# EAGLE design 8x8-LED-Matrix-Rev3 (EAGLE 5.11)
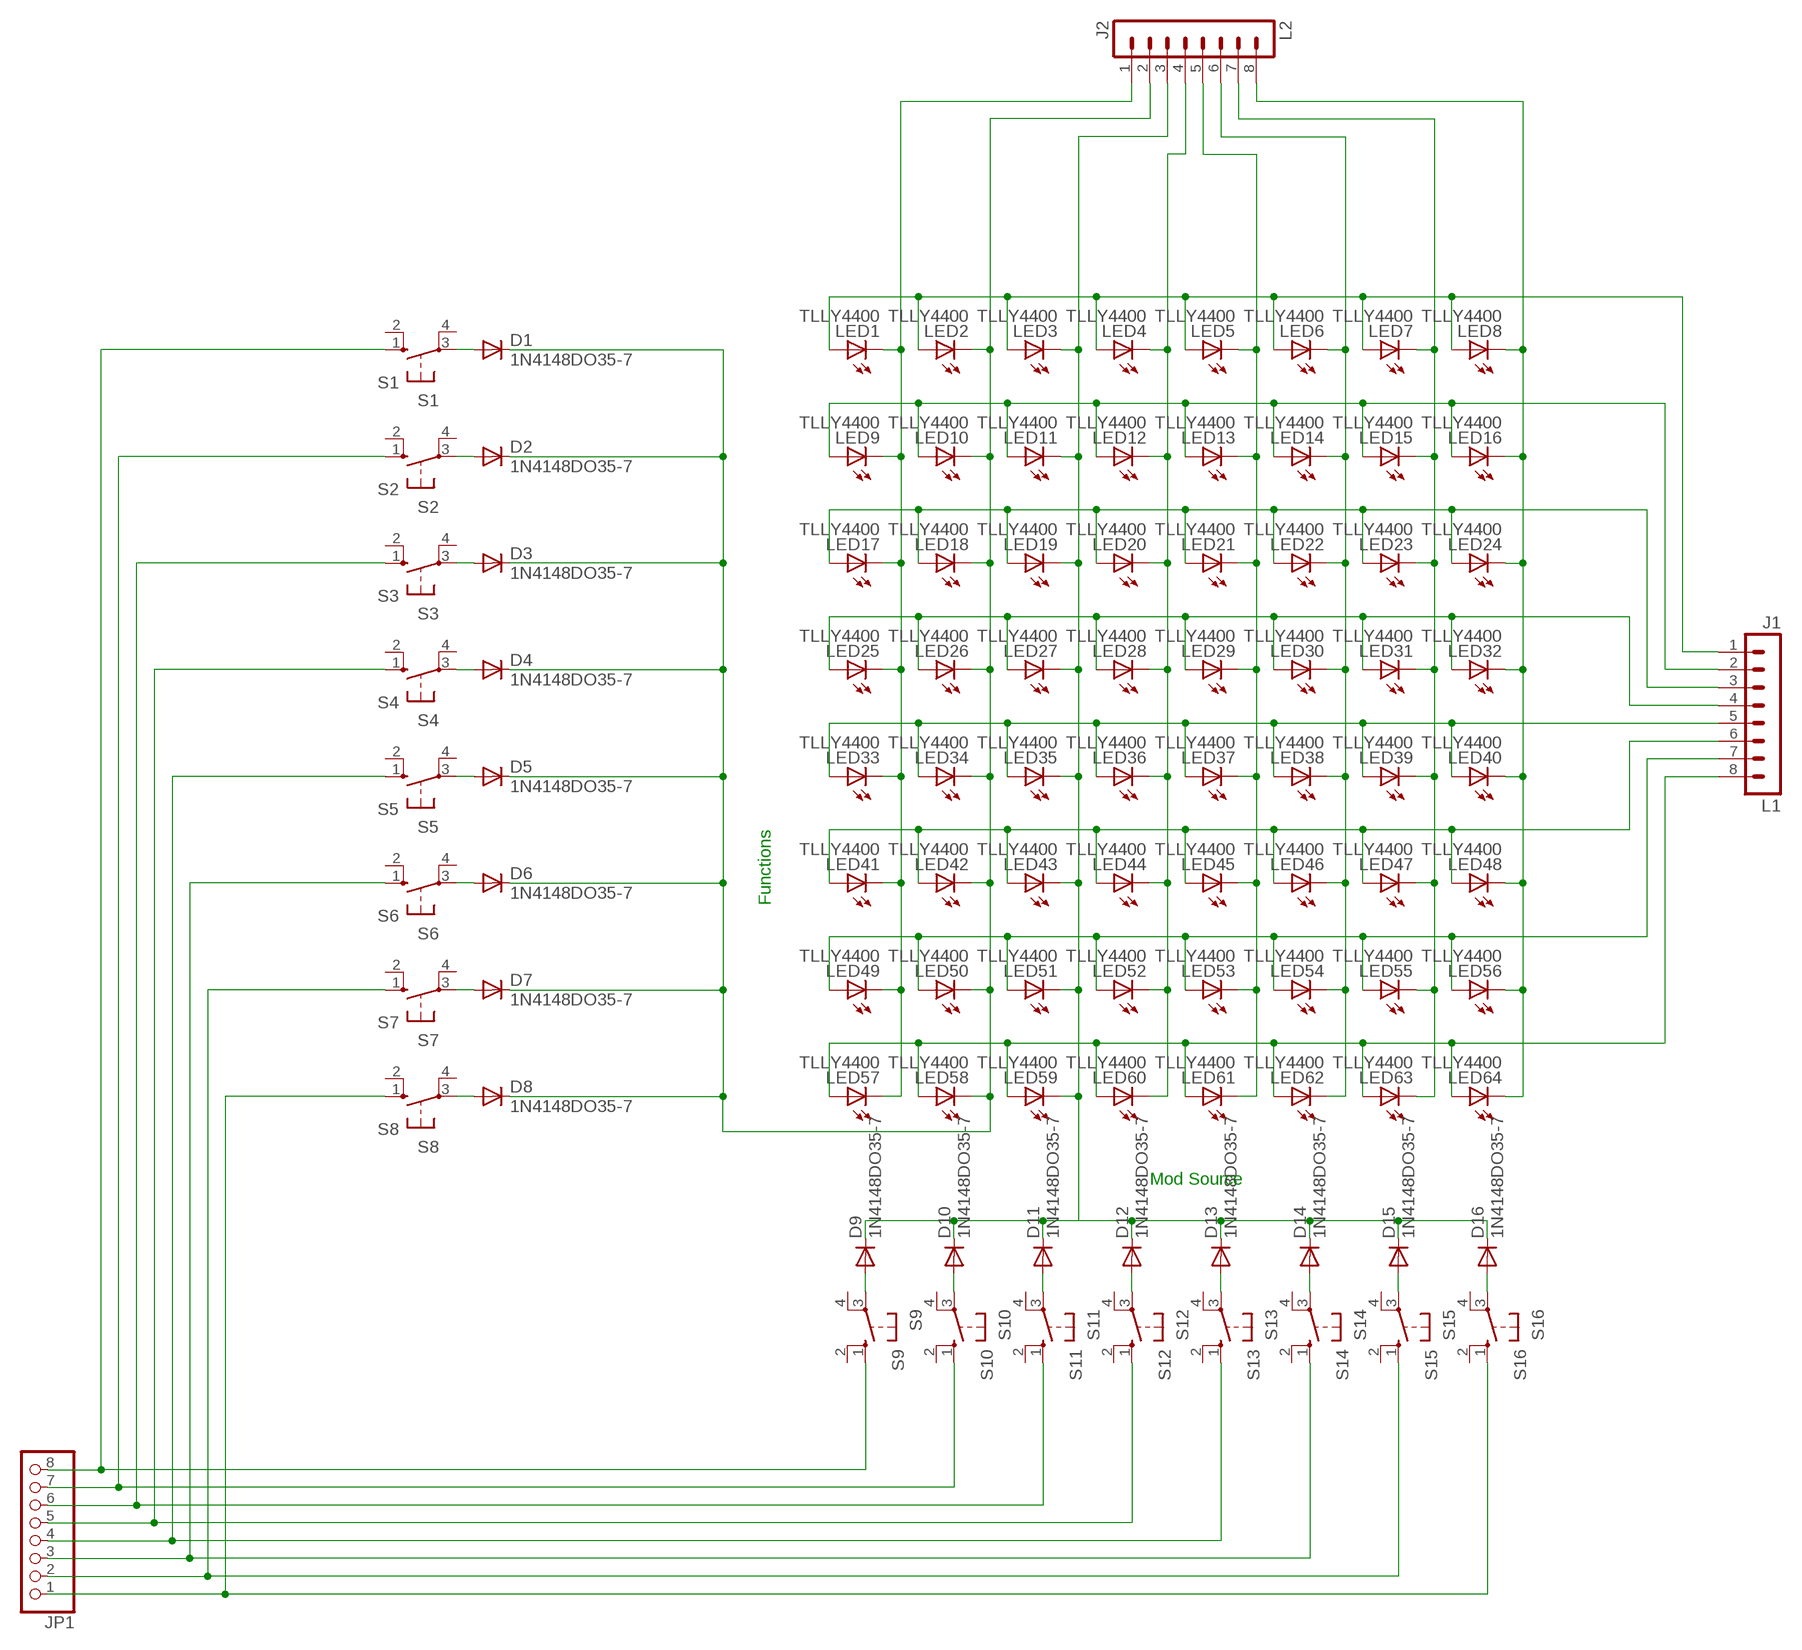
[diagram p0: schematic, sheet 1]

## Parts
D1  1N4148DO35-7  [DO35-7]
D2  1N4148DO35-7  [DO35-7]
D3  1N4148DO35-7  [DO35-7]
D4  1N4148DO35-7  [DO35-7]
D5  1N4148DO35-7  [DO35-7]
D6  1N4148DO35-7  [DO35-7]
D7  1N4148DO35-7  [DO35-7]
D8  1N4148DO35-7  [DO35-7]
D9  1N4148DO35-7  [DO35-7]
D10  1N4148DO35-7  [DO35-7]
D11  1N4148DO35-7  [DO35-7]
D12  1N4148DO35-7  [DO35-7]
D13  1N4148DO35-7  [DO35-7]
D14  1N4148DO35-7  [DO35-7]
D15  1N4148DO35-7  [DO35-7]
D16  1N4148DO35-7  [DO35-7]
JP1  PINHD-1X8  [1X08]
L1  J1  MA08-1  [MA08-1]
L2  J2  MA08-1  [MA08-1]
LED1  TLLY4400  [LED3MM]
LED2  TLLY4400  [LED3MM]
LED3  TLLY4400  [LED3MM]
LED4  TLLY4400  [LED3MM]
LED5  TLLY4400  [LED3MM]
LED6  TLLY4400  [LED3MM]
LED7  TLLY4400  [LED3MM]
LED8  TLLY4400  [LED3MM]
LED9  TLLY4400  [LED3MM]
LED10  TLLY4400  [LED3MM]
LED11  TLLY4400  [LED3MM]
LED12  TLLY4400  [LED3MM]
LED13  TLLY4400  [LED3MM]
LED14  TLLY4400  [LED3MM]
LED15  TLLY4400  [LED3MM]
LED16  TLLY4400  [LED3MM]
LED17  TLLY4400  [LED3MM]
LED18  TLLY4400  [LED3MM]
LED19  TLLY4400  [LED3MM]
LED20  TLLY4400  [LED3MM]
LED21  TLLY4400  [LED3MM]
LED22  TLLY4400  [LED3MM]
LED23  TLLY4400  [LED3MM]
LED24  TLLY4400  [LED3MM]
LED25  TLLY4400  [LED3MM]
LED26  TLLY4400  [LED3MM]
LED27  TLLY4400  [LED3MM]
LED28  TLLY4400  [LED3MM]
LED29  TLLY4400  [LED3MM]
LED30  TLLY4400  [LED3MM]
LED31  TLLY4400  [LED3MM]
LED32  TLLY4400  [LED3MM]
LED33  TLLY4400  [LED3MM]
LED34  TLLY4400  [LED3MM]
LED35  TLLY4400  [LED3MM]
LED36  TLLY4400  [LED3MM]
LED37  TLLY4400  [LED3MM]
LED38  TLLY4400  [LED3MM]
LED39  TLLY4400  [LED3MM]
LED40  TLLY4400  [LED3MM]
LED41  TLLY4400  [LED3MM]
LED42  TLLY4400  [LED3MM]
LED43  TLLY4400  [LED3MM]
LED44  TLLY4400  [LED3MM]
LED45  TLLY4400  [LED3MM]
LED46  TLLY4400  [LED3MM]
LED47  TLLY4400  [LED3MM]
LED48  TLLY4400  [LED3MM]
LED49  TLLY4400  [LED3MM]
LED50  TLLY4400  [LED3MM]
LED51  TLLY4400  [LED3MM]
LED52  TLLY4400  [LED3MM]
LED53  TLLY4400  [LED3MM]
LED54  TLLY4400  [LED3MM]
LED55  TLLY4400  [LED3MM]
LED56  TLLY4400  [LED3MM]
LED57  TLLY4400  [LED3MM]
LED58  TLLY4400  [LED3MM]
LED59  TLLY4400  [LED3MM]
LED60  TLLY4400  [LED3MM]
LED61  TLLY4400  [LED3MM]
LED62  TLLY4400  [LED3MM]
LED63  TLLY4400  [LED3MM]
LED64  TLLY4400  [LED3MM]
S1  S1  10-XX  [B3F-10XX]
S2  S2  10-XX  [B3F-10XX]
S3  S3  10-XX  [B3F-10XX]
S4  S4  10-XX  [B3F-10XX]
S5  S5  10-XX  [B3F-10XX]
S6  S6  10-XX  [B3F-10XX]
S7  S7  10-XX  [B3F-10XX]
S8  S8  10-XX  [B3F-10XX]
S9  S9  10-XX  [B3F-10XX]
S10  S10  10-XX  [B3F-10XX]
S11  S11  10-XX  [B3F-10XX]
S12  S12  10-XX  [B3F-10XX]
S13  S13  10-XX  [B3F-10XX]
S14  S14  10-XX  [B3F-10XX]
S15  S15  10-XX  [B3F-10XX]
S16  S16  10-XX  [B3F-10XX]

## Nets
N$1: L1.1 LED1.A LED2.A LED3.A LED4.A LED5.A LED6.A LED7.A LED8.A
N$2: L1.2 LED9.A LED10.A LED11.A LED12.A LED13.A LED14.A LED15.A LED16.A
N$3: L1.3 LED17.A LED18.A LED19.A LED20.A LED21.A LED22.A LED23.A LED24.A
N$4: L1.4 LED25.A LED26.A LED27.A LED28.A LED29.A LED30.A LED31.A LED32.A
N$5: L1.5 LED33.A LED34.A LED35.A LED36.A LED37.A LED38.A LED39.A LED40.A
N$6: L1.6 LED41.A LED42.A LED43.A LED44.A LED45.A LED46.A LED47.A LED48.A
N$7: D3.A S3.3(P)
N$8: L1.8 LED57.A LED58.A LED59.A LED60.A LED61.A LED62.A LED63.A LED64.A
N$9: L2.1 LED1.K(C) LED9.K(C) LED17.K(C) LED25.K(C) LED33.K(C) LED41.K(C) LED49.K(C) LED57.K(C)
N$10: D1.C D2.C D3.C D4.C D5.C D6.C D7.C D8.C L2.2 LED2.K(C) LED10.K(C) LED18.K(C) LED26.K(C) LED34.K(C) LED42.K(C) LED50.K(C) LED58.K(C)
N$11: D9.C D10.C D11.C D12.C D13.C D14.C D15.C D16.C L2.3 LED3.K(C) LED11.K(C) LED19.K(C) LED27.K(C) LED35.K(C) LED43.K(C) LED51.K(C) LED59.K(C)
N$12: L2.4 LED4.K(C) LED12.K(C) LED20.K(C) LED28.K(C) LED36.K(C) LED44.K(C) LED52.K(C) LED60.K(C)
N$13: L2.5 LED5.K(C) LED13.K(C) LED21.K(C) LED29.K(C) LED37.K(C) LED45.K(C) LED53.K(C) LED61.K(C)
N$14: L2.6 LED6.K(C) LED14.K(C) LED22.K(C) LED30.K(C) LED38.K(C) LED46.K(C) LED54.K(C) LED62.K(C)
N$15: L2.7 LED7.K(C) LED15.K(C) LED23.K(C) LED31.K(C) LED39.K(C) LED47.K(C) LED55.K(C) LED63.K(C)
N$16: L2.8 LED8.K(C) LED16.K(C) LED24.K(C) LED32.K(C) LED40.K(C) LED48.K(C) LED56.K(C) LED64.K(C)
N$17: L1.7 LED49.A LED50.A LED51.A LED52.A LED53.A LED54.A LED55.A LED56.A
N$18: JP1.8 S1.1(S) S9.1(S)
N$19: JP1.7 S2.1(S) S10.1(S)
N$20: JP1.5 S4.1(S) S12.1(S)
N$21: JP1.4 S5.1(S) S13.1(S)
N$22: JP1.3 S6.1(S) S14.1(S)
N$23: JP1.2 S7.1(S) S15.1(S)
N$24: JP1.1 S8.1(S) S16.1(S)
N$25: JP1.6 S3.1(S) S11.1(S)
N$26: D4.A S4.3(P)
N$27: D5.A S5.3(P)
N$28: D6.A S6.3(P)
N$29: D7.A S7.3(P)
N$30: D8.A S8.3(P)
N$32: D9.A S9.3(P)
N$33: D10.A S10.3(P)
N$38: D11.A S11.3(P)
N$39: D12.A S12.3(P)
N$40: D13.A S13.3(P)
N$41: D14.A S14.3(P)
N$42: D15.A S15.3(P)
N$43: D16.A S16.3(P)
N$48: D1.A S1.3(P)
N$49: D2.A S2.3(P)
Unconnected: S1.2(S1) S1.4(P1) S2.2(S1) S2.4(P1) S3.2(S1) S3.4(P1) S4.2(S1) S4.4(P1) S5.2(S1) S5.4(P1) S6.2(S1) S6.4(P1) S7.2(S1) S7.4(P1) S8.2(S1) S8.4(P1) S9.2(S1) S9.4(P1) S10.2(S1) S10.4(P1) S11.2(S1) S11.4(P1) S12.2(S1) S12.4(P1) S13.2(S1) S13.4(P1) S14.2(S1) S14.4(P1) S15.2(S1) S15.4(P1) S16.2(S1) S16.4(P1)

## Notes on the sheet
- Functions
- Mod Source

## Library data of the parts
D1-D16 = diode:1N4148: DIODE high speed (Philips)
JP1 = pinhead:PINHD-1X8: PIN HEADER
L1 L2 = con-lstb:MA08-1: PIN HEADER; OC_FARNELL: unknown; OC_NEWARK: unknown
LED1-LED64 = led:TLLY4400: Low Current (2mA) LED 3 mm Tinted Diffused Package color YELLOW Source: Data sheet <http://www.farnell.com/datasheets/391098.pdf>; MF: VISHAY SEMICONDUCTOR; OC_FARNELL: 1612439
S1-S16 = switch-omron:10-XX: OMRON SWITCH; MPN: B3F-1000; OC_FARNELL: 176432; OC_NEWARK: 36M3542

## Board
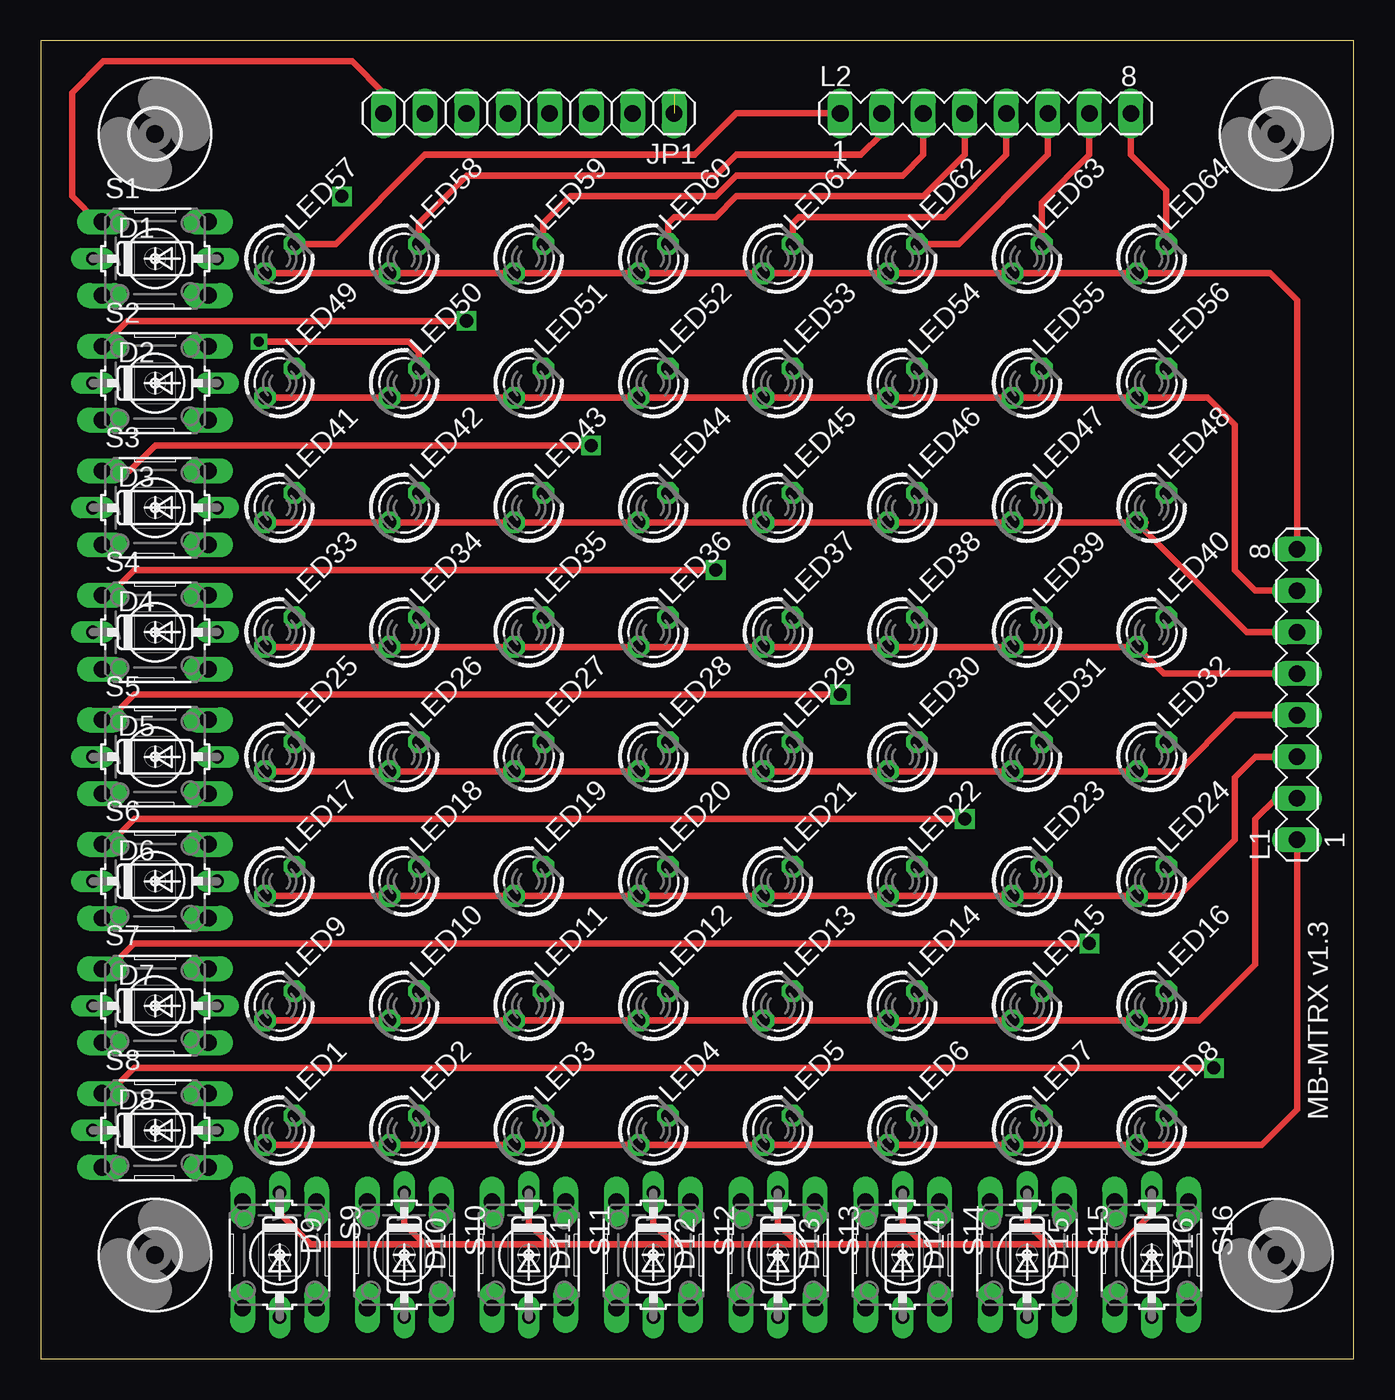
[diagram p1: board, top side]
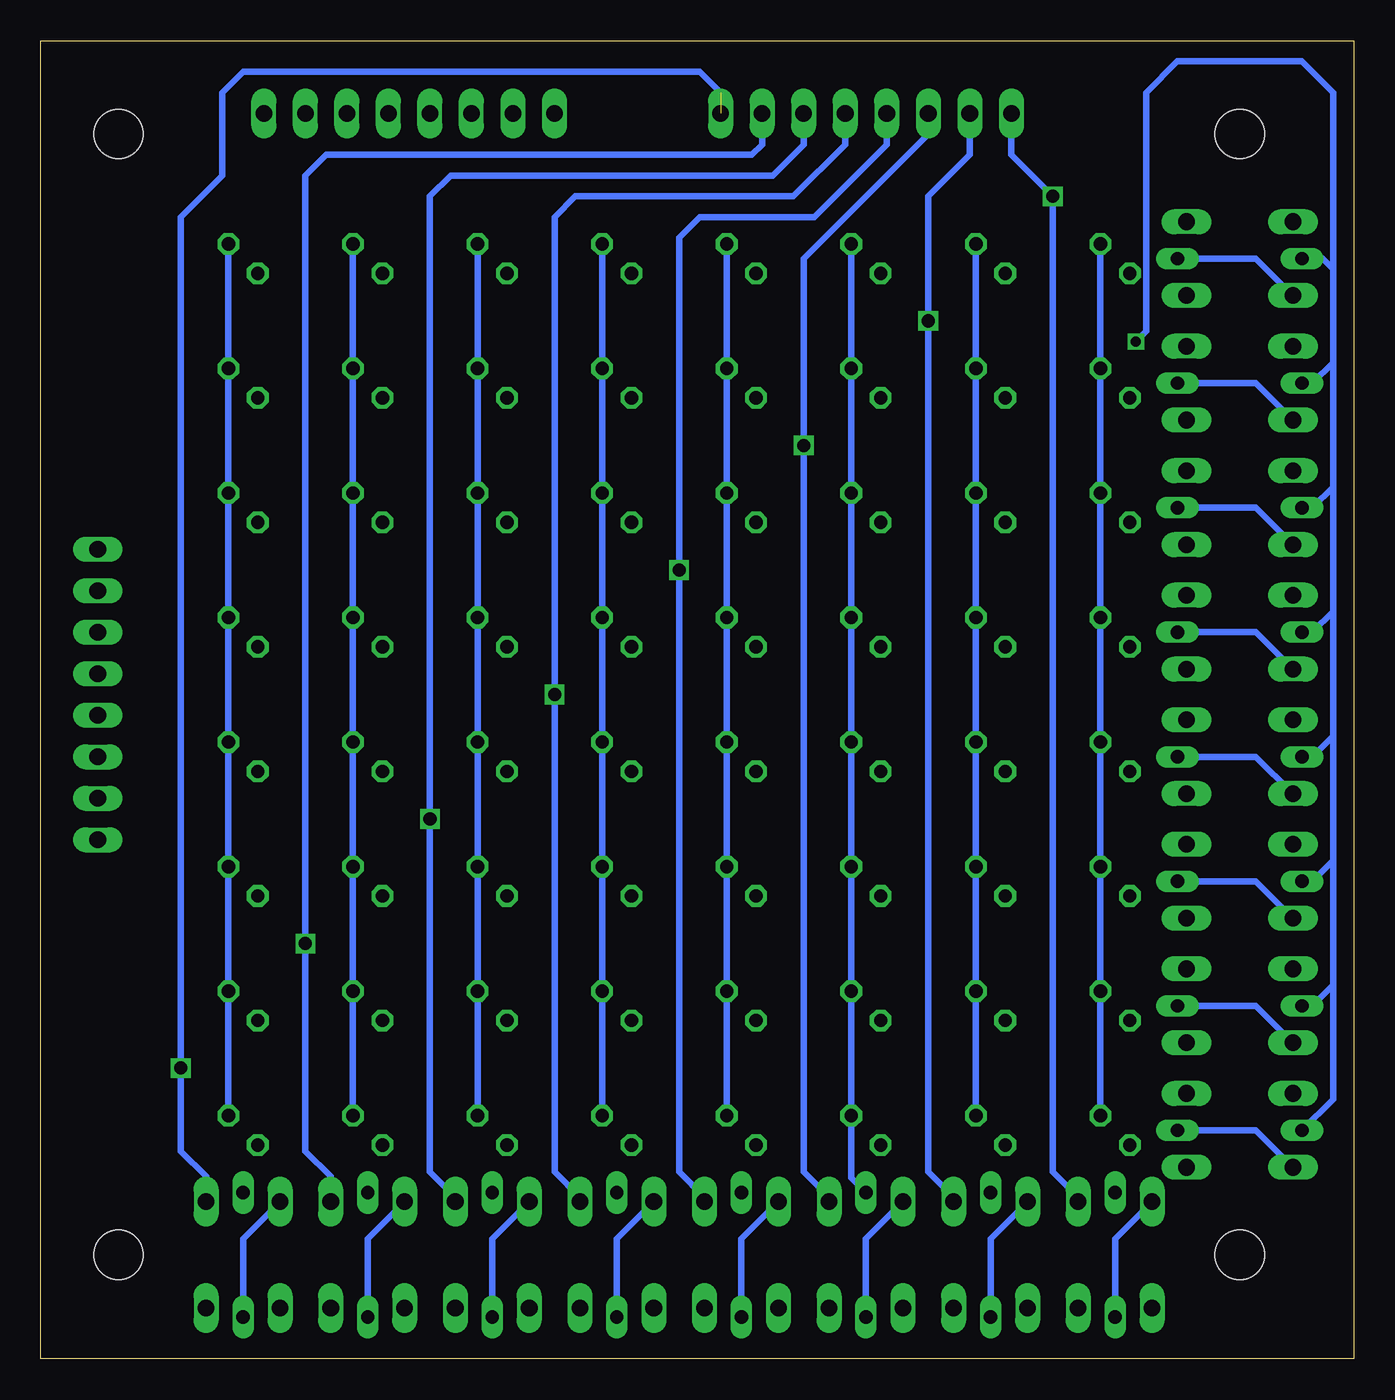
[diagram p2: board, bottom side, seen from below]

Size 80.31 x 80.64 mm. Coordinates in mm from the lower left corner, seen from the top.
Outline: 0,0 80.31,0 80.31,80.64 0,80.64 0,0
Copper layers (1*16): Top 0.035mm / dielectric 1.5mm / Bottom 0.035mm
Design rules "batchpcb": minimum track width 8mil, minimum drill 20mil, track to track 8mil, track to pad 8mil, pad to pad 8mil, via to via 8mil, smd to smd 8mil, copper to edge 40mil, drill to drill 8mil, minimum pad ring 10mil, minimum via ring 8mil, stop-mask expansion 4mil, vias tented up to drill 0mil, thermal gap 10mil

### Footprints (pad centres in the part's own frame; a part is rotated, then mirrored left to right if it is on the bottom)
DO35-7 = drill 0.813 long: A 3.81,0; C -3.81,0
1X08 = drill 1.016 long: 1 -8.89,0; 2 -6.35,0; 3 -3.81,0; 4 -1.27,0; 5 1.27,0; 6 3.81,0; 7 6.35,0; 8 8.89,0
MA08-1 = drill 1.016 long: 1 -8.89,0; 2 -6.35,0; 3 -3.81,0; 4 -1.27,0; 5 1.27,0; 6 3.81,0; 7 6.35,0; 8 8.89,0
LED3MM = drill 0.813 octagon: A -1.27,0; K 1.27,0
B3F-10XX = drill 1.016 long: 1 -3.251,2.261; 2 3.251,2.261; 3 -3.251,-2.261; 4 3.251,-2.261
3,0 = hole 3: 0,0

### Placement (x,y rotation side)
D1  6.99,67.31 0 top
D2  6.99,59.69 0 top
D3  6.99,52.07 0 top
D4  6.99,44.45 0 top
D5  6.99,36.83 0 top
D6  6.99,29.21 0 top
D7  6.99,21.59 0 top
D8  6.99,13.97 0 top
D9  14.61,6.35 270 top
D10  22.23,6.35 270 top
D11  29.84,6.35 270 top
D12  37.47,6.35 270 top
D13  45.09,6.35 270 top
D14  52.7,6.35 270 top
D15  60.33,6.35 270 top
D16  67.94,6.35 270 top
JP1  29.84,76.2 180 top
L1  76.83,40.64 90 top
L2  57.78,76.2 0 top
LED1  14.61,13.97 45 top
LED2  22.23,13.97 45 top
LED3  29.84,13.97 45 top
LED4  37.47,13.97 45 top
LED5  45.09,13.97 45 top
LED6  52.7,13.97 45 top
LED7  60.33,13.97 45 top
LED8  67.94,13.97 45 top
LED9  14.61,21.59 45 top
LED10  22.23,21.59 45 top
LED11  29.84,21.59 45 top
LED12  37.47,21.59 45 top
LED13  45.09,21.59 45 top
LED14  52.7,21.59 45 top
LED15  60.33,21.59 45 top
LED16  67.94,21.59 45 top
LED17  14.61,29.21 45 top
LED18  22.23,29.21 45 top
LED19  29.84,29.21 45 top
LED20  37.47,29.21 45 top
LED21  45.09,29.21 45 top
LED22  52.7,29.21 45 top
LED23  60.33,29.21 45 top
LED24  67.94,29.21 45 top
LED25  14.61,36.83 45 top
LED26  22.23,36.83 45 top
LED27  29.84,36.83 45 top
LED28  37.47,36.83 45 top
LED29  45.09,36.83 45 top
LED30  52.7,36.83 45 top
LED31  60.33,36.83 45 top
LED32  67.94,36.83 45 top
LED33  14.61,44.45 45 top
LED34  22.23,44.45 45 top
LED35  29.84,44.45 45 top
LED36  37.47,44.45 45 top
LED37  45.09,44.45 45 top
LED38  52.7,44.45 45 top
LED39  60.33,44.45 45 top
LED40  67.94,44.45 45 top
LED41  14.61,52.07 45 top
LED42  22.23,52.07 45 top
LED43  29.84,52.07 45 top
LED44  37.47,52.07 45 top
LED45  45.09,52.07 45 top
LED46  52.7,52.07 45 top
LED47  60.33,52.07 45 top
LED48  67.94,52.07 45 top
LED49  14.61,59.69 45 top
LED50  22.23,59.69 45 top
LED51  29.84,59.69 45 top
LED52  37.47,59.69 45 top
LED53  45.09,59.69 45 top
LED54  52.7,59.69 45 top
LED55  60.33,59.69 45 top
LED56  67.94,59.69 45 top
LED57  14.61,67.31 45 top
LED58  22.23,67.31 45 top
LED59  29.84,67.31 45 top
LED60  37.47,67.31 45 top
LED61  45.09,67.31 45 top
LED62  52.7,67.31 45 top
LED63  60.33,67.31 45 top
LED64  67.94,67.31 45 top
S1  6.99,67.31 0 top
S2  6.99,59.69 0 top
S3  6.99,52.07 0 top
S4  6.99,44.45 0 top
S5  6.99,36.83 0 top
S6  6.99,29.21 0 top
S7  6.99,21.59 0 top
S8  6.99,13.97 0 top
S9  14.61,6.35 270 top
S10  22.23,6.35 270 top
S11  29.84,6.35 270 top
S12  37.47,6.35 270 top
S13  45.09,6.35 270 top
S14  52.7,6.35 270 top
S15  60.33,6.35 270 top
S16  67.94,6.35 270 top
U$1  [3,0]  6.99,74.93 0 top
U$2  [3,0]  75.56,74.93 0 top
U$3  [3,0]  75.56,6.35 0 top
U$4  [3,0]  6.99,6.35 0 top

### Tracks (layer width: path | path; a pad name or v marks a point on that pad's centre or on a via)
N$1
  Top 0.406: L1.1 76.83,15.24 74.67,13.07 LED8.A LED7.A LED6.A LED5.A LED4.A LED3.A LED2.A LED1.A
N$2
  Top 0.406: L1.2 75.56,34.29 74.3,33.02 74.3,24.13 70.86,20.69 LED16.A LED15.A LED14.A LED13.A LED12.A LED11.A LED10.A LED9.A
N$3
  Top 0.406: L1.3 74.3,36.83 73.03,35.56 73.03,31.75 69.59,28.31 LED24.A LED23.A LED22.A LED21.A LED20.A LED19.A LED18.A LED17.A
N$4
  Top 0.406: L1.4 73.03,39.37 69.59,35.93 LED32.A LED31.A LED30.A LED29.A LED28.A LED27.A LED26.A LED25.A
N$5
  Top 0.406: L1.5 68.69,41.91 LED40.A LED39.A LED38.A LED37.A LED36.A LED35.A LED34.A LED33.A
N$6
  Top 0.406: LED48.A 67.57,51.17 | L1.6 73.77,44.45 LED48.A | LED41.A LED42.A LED43.A LED44.A LED45.A LED46.A LED47.A LED48.A
N$7
  Bottom 0.406: D3.A 5.99,52.07 S3.3
N$8
  Top 0.406: LED57.A LED58.A LED59.A LED60.A LED61.A LED62.A LED63.A LED64.A 75.19,66.41 76.83,64.77 L1.8
N$9
  Top 0.406: LED57.K 18.04,68.21 23.5,73.66 40.01,73.66 42.55,76.2 L2.1
  Bottom 0.406: LED57.K LED49.K LED41.K LED33.K LED25.K LED17.K LED9.K LED1.K
N$10  (via drill 0.6)
  Top 0.406: LED58.K 23.12,69.48 26.04,72.39 41.27,72.39 42.55,73.66 50.16,73.66 51.44,74.93 L2.2 | v13.34,62.23 22.49,62.23 23.12,61.59 LED50.K
  Bottom 0.406: LED58.K LED50.K LED42.K LED34.K LED26.K LED18.K LED10.K LED2.K | 1.27,22.86 1.27,15.88 D8.C | 1.27,22.86 1.27,30.48 | 1.27,30.48 1.27,38.1 | 1.27,38.1 1.27,45.72 | 1.27,45.72 1.27,53.34 | 1.27,53.34 1.27,60.96 | D7.C 2.54,21.59 1.27,22.86 | D6.C 2.54,29.21 1.27,30.48 | D5.C 2.54,36.83 1.27,38.1 | D4.C 2.54,44.45 1.27,45.72 | D3.C 2.54,52.07 1.27,53.34 | D2.C 2.54,59.69 1.27,60.96 | 1.27,60.96 1.27,66.67 | D1.C 1.91,67.31 1.27,66.67 | 1.27,66.67 1.27,77.47 3.17,79.38 10.79,79.38 12.7,77.47 12.7,62.87 v13.34,62.23
N$11
  Top 0.406: LED59.K 30.74,69.48 32.38,71.12 41.27,71.12 42.55,72.39 52.7,72.39 53.98,73.66 L2.3 | D9.C 14.61,8.89 16.51,6.99 23.5,6.99 | 23.5,6.99 31.11,6.99 | 31.11,6.99 38.73,6.99 | 38.73,6.99 46.35,6.99 | 46.35,6.99 53.98,6.99 | 53.98,6.99 61.59,6.99 | 61.59,6.99 66.04,6.99 67.94,8.89 D16.C | D15.C 60.33,8.26 61.59,6.99 | D14.C 52.7,8.26 53.98,6.99 | D13.C 45.09,8.26 46.35,6.99 | D12.C 37.47,8.26 38.73,6.99 | D11.C 29.84,8.26 31.11,6.99 | D10.C 22.23,8.26 23.5,6.99
  Bottom 0.406: LED59.K LED51.K LED43.K LED35.K LED27.K LED19.K LED11.K LED3.K 30.74,11.06 D11.C
N$12
  Top 0.406: LED60.K 38.36,69.48 38.73,69.85 41.27,69.85 42.55,71.12 53.98,71.12 56.52,73.66 L2.4
  Bottom 0.406: LED60.K LED52.K LED44.K LED36.K LED28.K LED20.K LED12.K LED4.K
N$13
  Top 0.406: LED61.K 45.98,69.48 46.35,69.85 55.24,69.85 59.05,73.66 L2.5
  Bottom 0.406: LED61.K LED53.K LED45.K LED37.K LED29.K LED21.K LED13.K LED5.K
N$14
  Top 0.406: LED62.K 56.14,68.21 61.59,73.66 L2.6
  Bottom 0.406: LED62.K LED54.K LED46.K LED38.K LED30.K LED22.K LED14.K LED6.K
N$15
  Top 0.406: LED63.K 61.22,70.75 64.14,73.66 L2.7
  Bottom 0.406: LED63.K LED55.K LED47.K LED39.K LED31.K LED23.K LED15.K LED7.K
N$16
  Top 0.406: LED64.K 68.84,71.49 66.67,73.66 L2.8
  Bottom 0.406: LED64.K LED56.K LED48.K LED40.K LED32.K LED24.K LED16.K LED8.K
N$17
  Top 0.406: L1.7 74.3,46.99 73.03,48.26 73.03,57.15 71.38,58.79 LED56.A LED55.A LED54.A LED53.A LED52.A LED51.A LED50.A LED49.A
N$18  (via drill 0.8)
  Top 0.406: S1.1 3.45,69.57 1.91,71.12 1.91,77.47 3.81,79.38 19.05,79.38 20.95,77.47 JP1.8
  Bottom 0.406: S9.1 16.87,9.88 18.41,11.43 v18.41,71.12 20.95,73.66 JP1.8
N$19  (via drill 0.8)
  Top 0.406: v26.04,63.5 5.28,63.5 S2.1
  Bottom 0.406: S10.1 24.49,9.88 26.04,11.43 v26.04,63.5 26.04,71.12 23.5,73.66 JP1.7
N$20  (via drill 0.8)
  Top 0.406: S4.1 4.17,46.71 5.71,48.26 v41.27,48.26
  Bottom 0.406: S12.1 39.73,9.88 41.27,11.43 v41.27,48.26 41.27,68.58 40.01,69.85 33.02,69.85 28.57,74.3 JP1.5
N$21  (via drill 0.8)
  Top 0.406: S5.1 4.17,39.09 5.71,40.64 v48.9,40.64
  Bottom 0.406: S13.1 47.35,9.88 48.9,11.43 v48.9,40.64 48.9,69.85 47.62,71.12 34.29,71.12 31.11,74.3 JP1.4
N$22  (via drill 0.8)
  Top 0.406: S6.1 4.17,31.47 5.71,33.02 v56.52,33.02
  Bottom 0.406: S14.1 54.97,9.88 56.52,11.43 v56.52,33.02 56.52,71.12 55.24,72.39 35.56,72.39 33.66,74.3 JP1.3
N$23  (via drill 0.8)
  Top 0.406: S7.1 4.17,23.85 5.71,25.4 v64.14,25.4
  Bottom 0.406: S15.1 62.59,11.15 64.14,12.7 v64.14,25.4 64.14,72.39 62.87,73.66 36.83,73.66 36.2,74.3 JP1.2
N$24  (via drill 0.8)  (1 unrouted)
  Top 0.406: S8.1 4.17,16.23 5.71,17.78 v71.75,17.78
  Bottom 0.406: S16.1 70.21,11.15 71.75,12.7 v71.75,17.78 71.75,69.85 69.22,72.39 69.22,77.47 67.94,78.74 40.01,78.74 38.73,77.47
N$25  (via drill 0.8)
  Top 0.406: S3.1 5.44,54.33 6.99,55.88 v33.66,55.88
  Bottom 0.406: S11.1 32.11,9.88 33.66,11.43 v33.66,55.88 33.66,67.31 26.04,74.93 JP1.6
N$26
  Bottom 0.406: D4.A 5.99,44.45 S4.3
N$27
  Bottom 0.406: D5.A 5.99,36.83 S5.3
N$28
  Bottom 0.406: D6.A 5.99,29.21 S6.3
N$29
  Bottom 0.406: D7.A 5.99,21.59 S7.3
N$30
  Bottom 0.406: D8.A 5.99,13.97 S8.3
N$32
  Bottom 0.406: D9.A 14.61,7.34 S9.3
N$33
  Bottom 0.406: D10.A 22.23,7.34 S10.3
N$38
  Bottom 0.406: D11.A 29.84,7.34 S11.3
N$39
  Bottom 0.406: D12.A 37.47,7.34 S12.3
N$40
  Bottom 0.406: D13.A 45.09,7.34 S13.3
N$41
  Bottom 0.406: D14.A 52.7,7.34 S14.3
N$42
  Bottom 0.406: D15.A 60.33,7.34 S15.3
N$43
  Bottom 0.406: D16.A 67.94,7.34 S16.3
N$48
  Bottom 0.406: D1.A 5.99,67.31 S1.3
N$49
  Bottom 0.406: D2.A 5.99,59.69 S2.3

### Text on the board
tNames: MB-MTRX v1.3